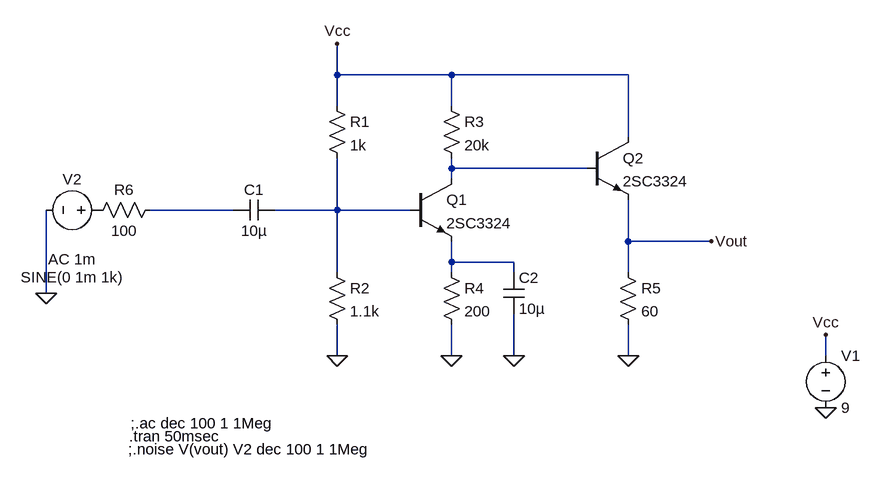
[diagram p0: schematic HW3-1d.asc]
HW3-1d.asc, the LTspice schematic file:
Version 4
SHEET 1 1144 680
WIRE 80 -80 80 -128
WIRE 256 -80 80 -80
WIRE 528 -80 256 -80
WIRE 80 -32 80 -80
WIRE 256 -32 256 -80
WIRE 528 16 528 -80
WIRE 256 64 256 48
WIRE 464 64 256 64
WIRE 256 80 256 64
WIRE -80 128 -208 128
WIRE 80 128 80 48
WIRE 80 128 -16 128
WIRE 192 128 80 128
WIRE 528 176 528 112
WIRE 656 176 528 176
WIRE 256 208 256 176
WIRE 352 208 256 208
WIRE 80 224 80 128
WIRE 256 224 256 208
WIRE 352 224 352 208
WIRE 528 224 528 176
WIRE -368 256 -368 128
WIRE 80 352 80 304
WIRE 256 352 256 304
WIRE 352 352 352 288
WIRE 528 352 528 304
WIRE 832 352 832 320
FLAG 832 432 0
FLAG 832 320 Vcc
FLAG 80 352 0
FLAG 256 352 0
FLAG 528 352 0
FLAG 352 352 0
FLAG -368 256 0
FLAG 80 -128 Vcc
FLAG 656 176 Vout
SYMBOL cap -16 112 R90
WINDOW 0 0 32 VBottom 2
WINDOW 3 32 32 VTop 2
SYMATTR InstName C1
SYMATTR Value 10µ
SYMBOL res 64 -48 R0
SYMATTR InstName R1
SYMATTR Value 1k
SYMBOL res 64 208 R0
SYMATTR InstName R2
SYMATTR Value 1.1k
SYMBOL npn 192 80 R0
SYMATTR InstName Q1
SYMATTR Value 2SC3324
SYMBOL res 240 -48 R0
SYMATTR InstName R3
SYMATTR Value 20k
SYMBOL res 240 208 R0
SYMATTR InstName R4
SYMATTR Value 200
SYMBOL npn 464 16 R0
SYMATTR InstName Q2
SYMATTR Value 2SC3324
SYMBOL cap 336 224 R0
SYMATTR InstName C2
SYMATTR Value 10µ
SYMBOL res 512 208 R0
SYMATTR InstName R5
SYMATTR Value 60
SYMBOL voltage 832 336 R0
WINDOW 123 0 0 Left 0
WINDOW 39 0 0 Left 0
SYMATTR InstName V1
SYMATTR Value 9
SYMBOL voltage -272 128 R90
WINDOW 0 -32 56 VBottom 2
WINDOW 3 88 56 VTop 2
WINDOW 123 60 56 VTop 2
WINDOW 39 0 0 Left 0
SYMATTR InstName V2
SYMATTR Value SINE(0 1m 1k)
SYMATTR Value2 AC 1m
SYMBOL res -192 112 R90
WINDOW 0 0 56 VBottom 2
WINDOW 3 32 56 VTop 2
SYMATTR InstName R6
SYMATTR Value 100
TEXT -238 456 Left 2 !;.ac dec 100 1 1Meg
TEXT -240 476 Left 2 !.tran 50msec
TEXT -242 496 Left 2 !;.noise V(vout) V2 dec 100 1 1Meg

The netlist it stands for:
* HW3-1d.asc
C1 N003 N002 10µ
R1 Vcc N003 1k
R2 N003 0 1.1k
Q1 N001 N003 N004 0 2SC3324
R3 Vcc N001 20k
R4 N004 0 200
Q2 Vcc N001 Vout 0 2SC3324
C2 N004 0 10µ
R5 Vout 0 60
V1 Vcc 0 9
V2 P001 0 SINE(0 1m 1k) AC 1m
R6 N002 P001 100
.model NPN NPN
.model PNP PNP
.lib standard.bjt
;.ac dec 100 1 1Meg
.tran 50msec
;.noise V(vout) V2 dec 100 1 1Meg
.backanno
.end